# EAGLE design Pressure Sensor (EAGLE 9.6.2)
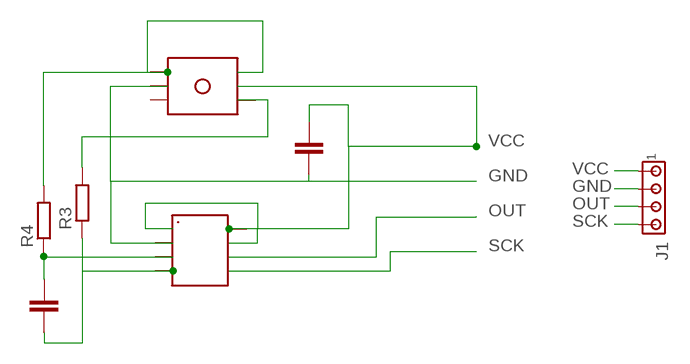
[diagram p0: schematic, sheet 1]

## Parts
C1  100n  C-EUC0805  [C0805]
C2  100n  C-EUC0805  [C0805]
J1  MTA04-100  [10X04MTA]
R3  R-EU_R0805  [R0805]
R4  R-EU_R0805  [R0805]
U$1  HX710B  [HX710B]
U$2  PRESSURE  [PRESSURE]

## Nets
GND: C1.2 J1.2 U$1.AGND U$2.2
N$1: C2.2 R4.1 U$1.INN
N$2: C2.1 R3.1 U$1.INP
N$3: R3.2 U$2.4
N$4: R4.2 U$2.1 U$2.6
OUT: J1.3 U$1.DOUT
SCK: J1.4 U$1.SCK
VCC: C1.1 J1.1 U$1.AVDD U$1.DVDD U$1.VREF U$2.5
Unconnected: U$2.3

## Library data of the parts
C1 C2 = rcl@1:C-EU: CAPACITOR, European symbol
J1 = con-amp:MTA04-100: AMP connector
R3 R4 = rcl:R-EU_: RESISTOR, European symbol; SPICEPREFIX: R
U$1 = HX710B:HX710B
U$2 = PRESSURE:PRESSURE

## Board
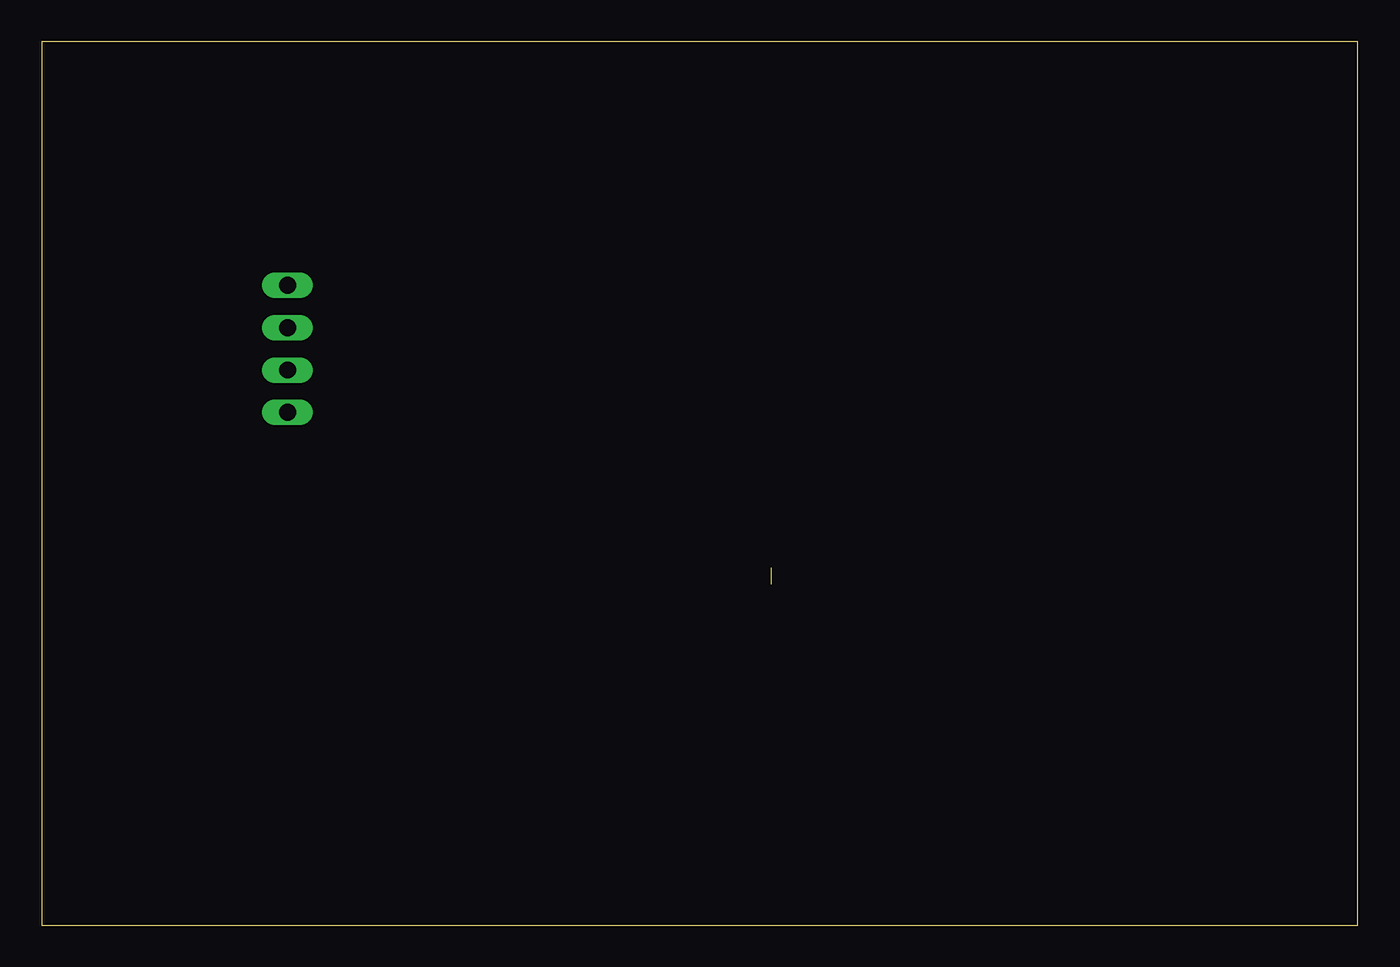
[diagram p1: board, top side]
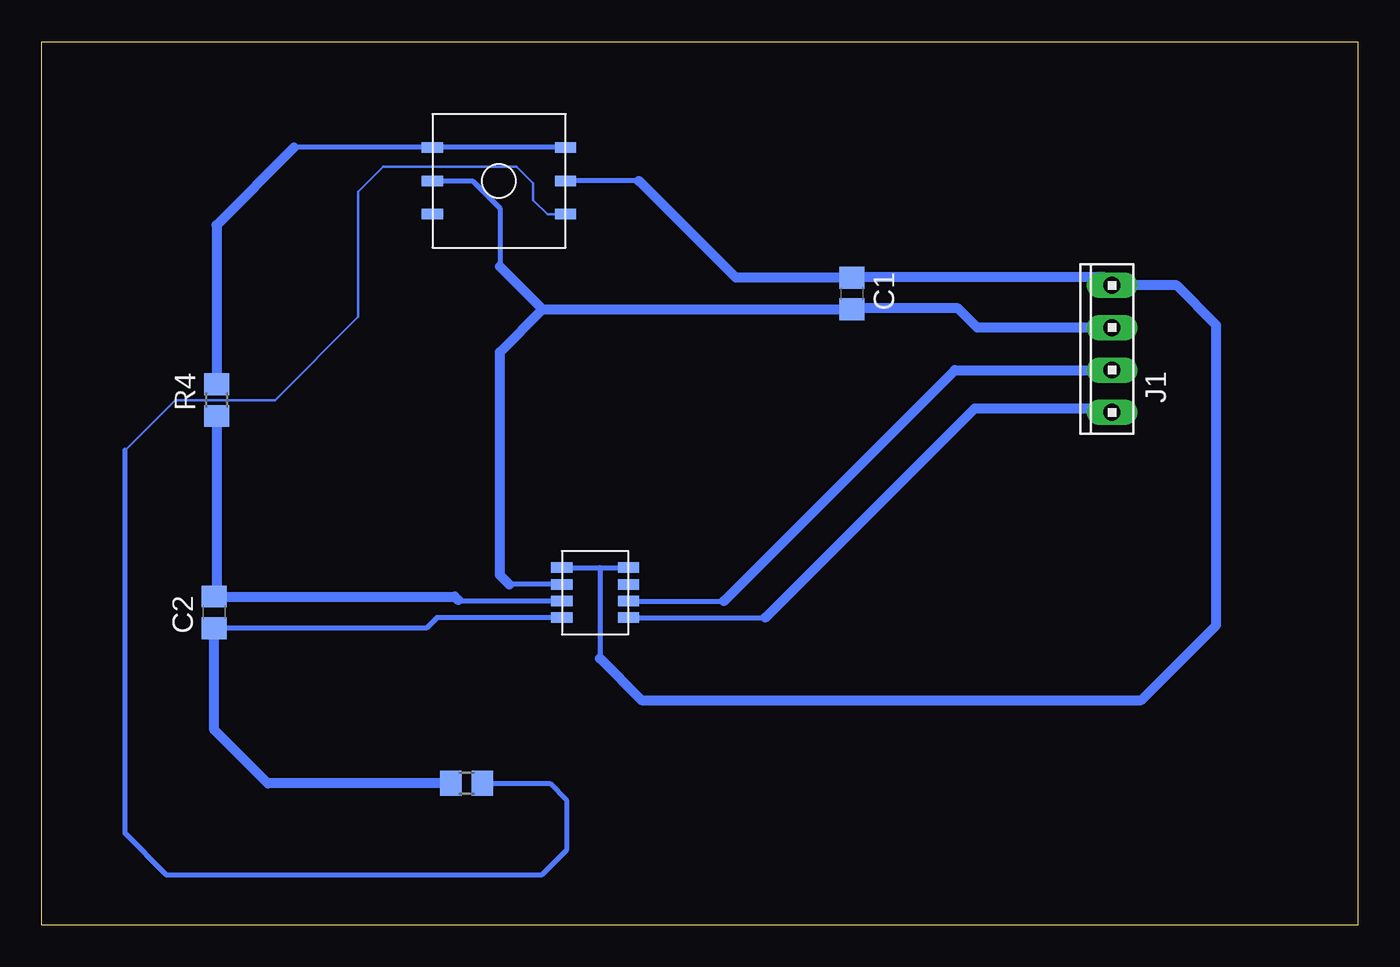
[diagram p2: board, bottom side, seen from below]

Size 79 x 53 mm. Coordinates in mm from the lower left corner, seen from the top.
Outline: 0,0 79,0 79,53 0,53 0,0
Copper layers (1*16): Top 0.035mm / dielectric 1.5mm / Bottom 0.035mm
Design rules "default": minimum track width 6mil, minimum drill 0.35mm, track to track 6mil, track to pad 6mil, pad to pad 6mil, via to via 6mil, smd to smd 6mil, copper to edge 40mil, drill to drill 6mil, minimum pad ring 10mil, minimum via ring 8mil, stop-mask expansion 4mil, vias tented up to drill 0mil, thermal gap 10mil

### Footprints (pad centres in the part's own frame; a part is rotated, then mirrored left to right if it is on the bottom)
C0805 = smd 1.3 x 1.5: 1 -0.95,0; 2 0.95,0
10X04MTA = drill 1.016 long: 1 3.81,0; 2 1.27,0; 3 -1.27,0; 4 -3.81,0
R0805 = smd 1.3 x 1.5: 1 -0.95,0; 2 0.95,0
HX710B = smd 1.27 x 0.635: AGND -5,4; AVDD -1,5; DOUT -1,3; DVDD -1,4; INN -5,3; INP -5,2; SCK -1,2; VREF -5,5
PRESSURE = smd 1.27 x 0.635: 1 -9,7; 2 -9,5; 3 -9,3; 4 -1,3; 5 -1,5; 6 -1,7

### Placement (x,y rotation side)
C1  30.36,37.89 270 bottom
C2  68.64,18.76 90 bottom
J1  14.76,34.57 90 bottom
R3  53.5,8.5 0 bottom
R4  68.5,31.5 90 bottom
U$1  42.78,16.44 0 bottom
U$2  46.55,39.65 0 bottom

### Tracks (layer width: path | path; a pad name or v marks a point on that pad's centre or on a via)
GND
  Bottom 0.305: U$2.2 53.15,44.65 51.5,43 51.5,39.5 | U$1.AGND 50.94,20.44
  Bottom 0.61: J1.2 22.84,35.84 24,37 30.3,37 C1.2 | 41.06,36.94 C1.2 | 51.5,39.5 48.94,36.94 | 48.94,36.94 C1.2 | 50.94,20.44 51.5,21 51.5,34.38 48.94,36.94
N$1
  Bottom 0.152: 53.94,19.44 54.21,19.71
  Bottom 0.305: U$1.INN 53.94,19.44
  Bottom 0.61: R4.1 68.5,19.85 C2.2 54.21,19.71 54,19.5
N$2
  Bottom 0.305: U$1.INP 55.28,18.44 55.91,17.81 C2.1
  Bottom 0.61: C2.1 68.64,11.71 65.43,8.5 R3.1
N$3
  Bottom 0.152: 74,28.5 71,31.5 65,31.5 60,36.5 60,44 58.5,45.5 50.5,45.5 49.5,44.5 49.5,43.5 48.65,42.65 U$2.4
  Bottom 0.305: R3.2 48.5,8.5 47.5,7.5 47.5,4.5 49,3 71.5,3 74,5.5 74,28.5
N$4
  Bottom 0.305: U$2.6 U$2.1 63.85,46.65
  Bottom 0.61: R4.2 68.5,42 63.85,46.65
OUT
  Bottom 0.305: U$1.DOUT 38.06,19.44
  Bottom 0.61: J1.3 24.2,33.3 38.06,19.44
SCK
  Bottom 0.305: U$1.SCK 35.56,18.44
  Bottom 0.61: 35.56,18.44 23,31 15,31 J1.4
VCC  (1 unrouted)
  Bottom 0.305: 43.15,44.65 U$2.5 | U$1.VREF 45.5,21.44 | 45.5,21.44 U$1.AVDD | 45.5,21.44 45.5,16
  Bottom 0.61: 43.15,44.65 37.34,38.84 C1.1 30.32,38.88 15.26,38.88 J1.1 10.88,38.38 8.5,36 8.5,18 13,13.5 43,13.5 45.5,16